# Altium schematic sheet MEMS&RF.SchDoc
size A4
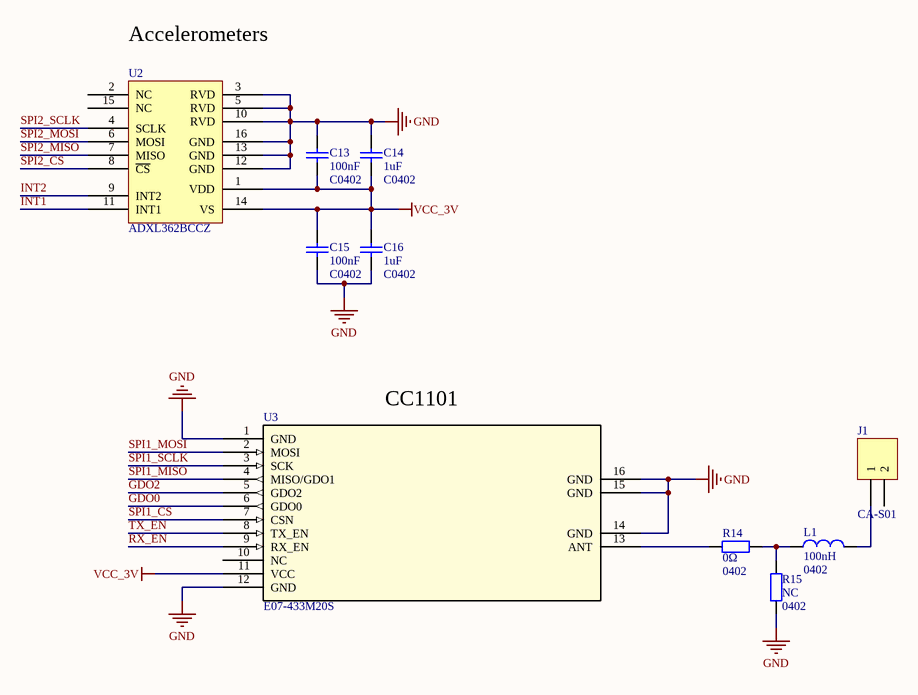
[diagram p0: MEMS&RF.SchDoc]

## Parts
C13  100nF  PackageReference: C0402  [0402]
C14  1uF  PackageReference: C0402  [0402]
C15  100nF  PackageReference: C0402  [0402]
C16  1uF  PackageReference: C0402  [0402]
J1  CA-S01  [CA-S01]
L1  100nH  [0402]
R14  0Ω  PackageReference: 0402  [RESC1005X04N]
R15  NC  PackageReference: 0402  [RESC1005X04N]
U2  ADXL362BCCZ  [LGA_CC-16-4]
U3  E07-433M20S  [PE07-433M20S]

## Nets
GND: C13.2 C14.2 C15.2 C16.1 R15.1 U2.3(RVD) U2.5(RVD) U2.10(RVD) U2.12(GND) U2.13(GND) U2.16(GND) U3.1(GND) U3.12(GND) U3.14(GND) U3.15(GND) U3.16(GND)
VCC_3V: C13.1 C14.1 C15.1 C16.2 U2.1(VDD) U2.14(VS) U3.11(VCC)
GDO0: U3.6(GDO0)
GDO2: U3.5(GDO2)
INT1: U2.11(INT1)
INT2: U2.9(INT2)
RX_EN: U3.9(RX_EN)
SPI1_CS: U3.7(CSN)
SPI1_MISO: U3.4(MISO/GDO1)
SPI1_MOSI: U3.2(MOSI)
SPI1_SCLK: U3.3(SCK)
SPI2_CS: U2.8(~{CS})
SPI2_MISO: U2.7(MISO)
SPI2_MOSI: U2.6(MOSI)
SPI2_SCLK: U2.4(SCLK)
TX_EN: U3.8(TX_EN)
NetJ1_1: J1.1 L1.2
NetL1_1: L1.1 R14.2 R15.2
NetR14_1: R14.1 U3.13(ANT)

Not connected (* = marked no-connect by the designer): J1 2; U2 2(NC) 15(NC); U3 10(NC)

## Notes on the sheet
- (near U2) Accelerometers
- (near U3) CC1101

## Library data of the parts
C13 C15 = GRM155R71H104KE14: Capacitor (0402,X7R,100nF,DC 50V,±10%) Murata; Published: 8-Jun-2000; LatestRevisionDate: 29-May-2009; LatestRevisionNote: IPC-7351 Footprint Added.; Publisher: Altium Limited; PackageDescription: Chip Capacitor; Value: 100nF
C14 C16 = GRM155R61E105KE11: Capacitor (0402,X5R,1uF,DC 25V,±10%) Murata; Published: 8-Jun-2000; LatestRevisionDate: 29-May-2009; LatestRevisionNote: IPC-7351 Footprint Added.; Publisher: Altium Limited; PackageDescription: Chip Capacitor; Value: 1uF
J1 = CA-S01: CrossAir Antenna，广州寒武纪电子科技有限公司; LatestRevisionDate: 17-Jul-2002; LatestRevisionNote: Re-released for DXP Platform.; Publisher: Altium Limited
L1 = LQW15ANR10J00: Inductor, 100n, 0402, ±5%, wire-wound type Murata; Published: 8-Jun-2000; LatestRevisionDate: 29-May-2009; LatestRevisionNote: IPC-7351 Footprint Added.; Publisher: Altium Limited; PackageDescription: Inductor; Value: 100nH; PackageReference: 0402
R14 R15 = RC0402JR: Resistor 0402(1005) 0Ω; PackageDescription: Chip Resistor, 2-Leads, Body 1.00x0.50mm, IPC Medium Density
  R14: Value: 0Ω
  R15: Value: NC
U2 = ADXL362BCCZ: ADXL362, LGA, CC-16-4.
U3 = E07-433M20S: E07-433M20S是基于美国原装进口CC1101由成都亿佰特设计生产的大功率CC1101无线模块，默认发射功率为100mW、内置PA的模块，做到了功耗与性能的平衡。SPI接口，收发一体，可以工作在433MHz主流ISM频段，支持开发低功耗，目前已经多种场景中广泛应用; Isupply(uA): 2; Vin(V): 2.1-3.6; Iout(max)(mA): 100; frequency(MHz): 433